# Altium schematic sheet Alimentacion_3.SchDoc
size A4
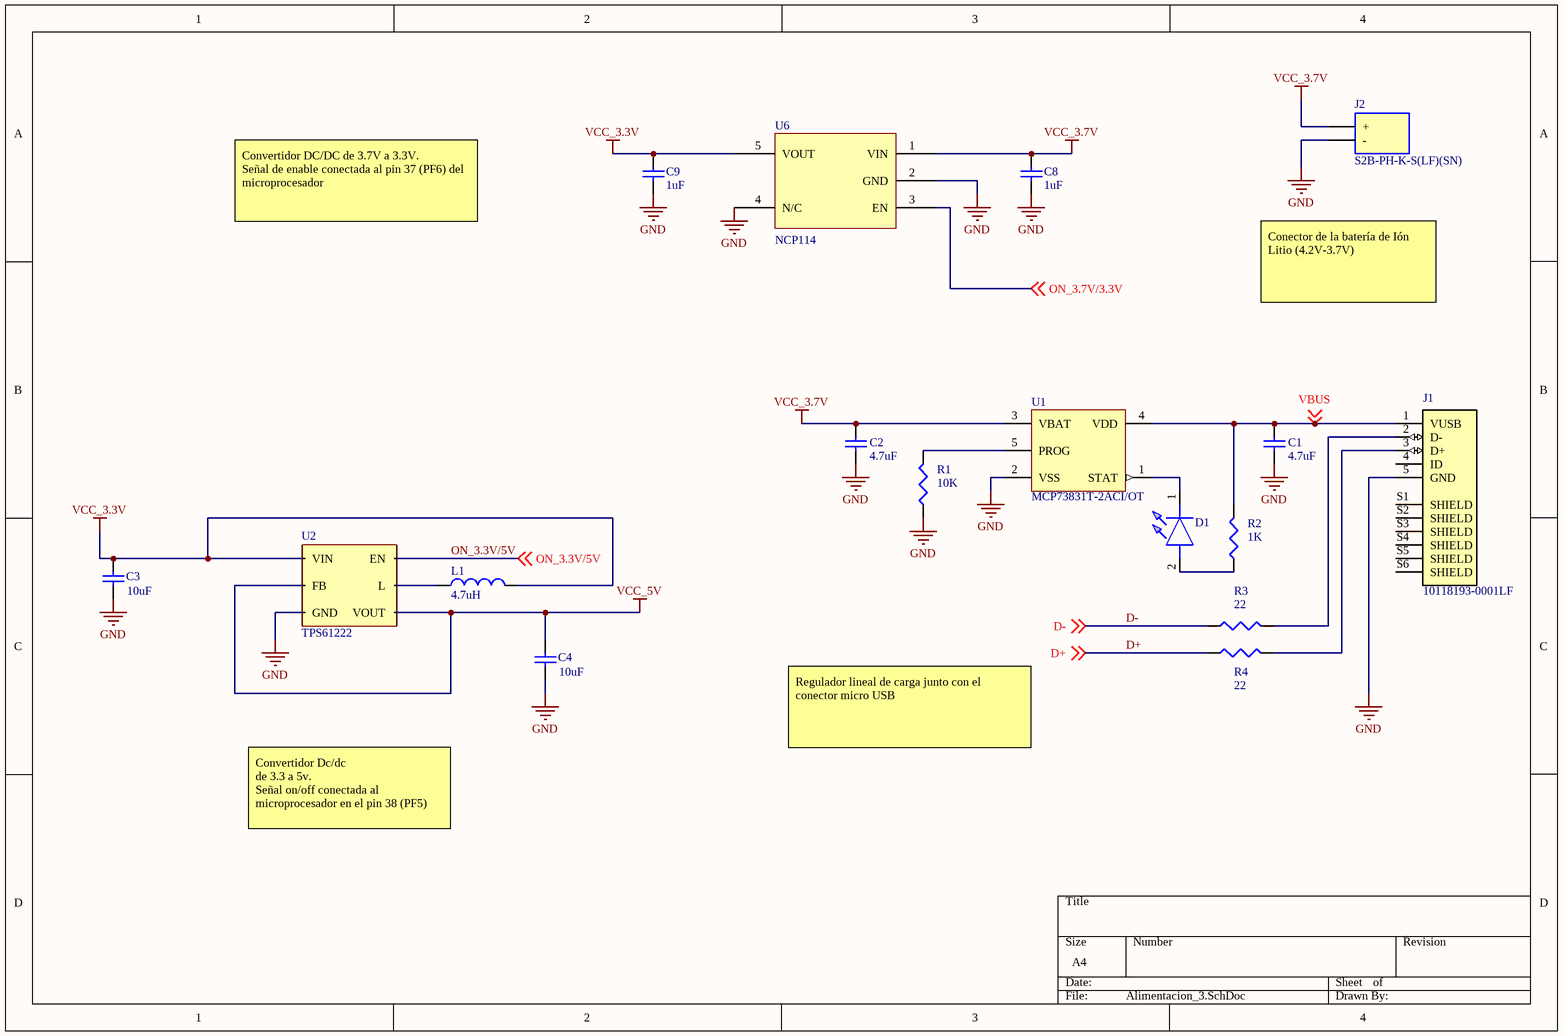
[diagram p0: Alimentacion_3.SchDoc]

## Parts
C1  value 4.7uF  [0603]  (hidden comment: Cap)
C2  value 4.7uF  [0603]  (hidden comment: Cap)
C3  value 10uF  [0603]  (hidden comment: Cap)
C4  value 10uF  [0603]  (hidden comment: Cap)
C8  value 1uF  [0603]  (hidden comment: Cap)
C9  value 1uF  [0603]  (hidden comment: Cap)
D1  150060GS75000  [LEDC1608X80N]  (value not drawn)
J1  10118193-0001LF  [FCI_10118193-0001LF_10118193-0001LF(Primary)]
J2  S2B-PH-K-S(LF)(SN)  [S2B_Lipo_Header]
L1  value 4.7uH  [0603]  (hidden comment: Inductor)
R1  value 10K  [0603]  (hidden comment: Res3)
R2  value 1K  [0603]  (hidden comment: Res3)
R3  value 22  [0603]  (hidden comment: Res3)
R4  value 22  [0603]  (hidden comment: Res3)
U1  MCP73831T-2ACI/OT  [SOT-23-OT5_N]
U2  TPS61222  [TPS61222DCK]
U6  NCP114  [NCP114-TSOP5]

## Nets
GND: C1.1 C2.1 C3.1 C4.1 C8.1 C9.1 J1.5(GND) J2.2(-) R1.1 U1.2(VSS) U2.GND U6.2(GND) U6.4(N/C)
VCC_3.3V: C3.2 C9.2 L1.2 U2.VIN U6.5(VOUT)
VCC_3.7V: C2.2 C8.2 J2.1(+) U1.3(VBAT) U6.1(VIN)
VCC_5V: C4.2 U2.FB U2.VOUT
D+: R4.1 ; off-sheet D+
D-: R3.1 ; off-sheet D-
ON_3.3V/5V: U2.EN ; off-sheet ON_3.3V/5V
ON_3.7V/3.3V: U6.3(EN) ; off-sheet ON_3.7V/3.3V
VBUS: C1.2 J1.1(VUSB) R2.2 U1.4(VDD) ; off-sheet VBUS
NetD1_1: D1.1(K) U1.1(STAT)
NetD1_2: D1.2(A) R2.1
NetJ1_2: J1.2(D-) R3.2
NetJ1_3: J1.3(D+) R4.2
NetL1_1: L1.1 U2.L
NetR1_2: R1.2 U1.5(PROG)

Not connected (* = marked no-connect by the designer): J1 4(ID) S1(SHIELD) S2(SHIELD) S3(SHIELD) S4(SHIELD) S5(SHIELD) S6(SHIELD)

## Notes on the sheet
- Convertidor DC/DC de 3.7V a 3.3V.
  Señal de enable conectada al pin 37 (PF6) del microprocesador
- Conector de la batería de Ión Litio (4.2V-3.7V)
- Regulador lineal de carga junto con el conector micro USB
- Convertidor Dc/dc
  de 3.3 a 5v.
  Señal on/off conectada al microprocesador en el pin 38 (PF5)

## Library data of the parts
C1-C4 C8 C9 = Cap_0603: Capacitor; Published: 8-Jun-2000; LatestRevisionDate: 17-Jul-2002; LatestRevisionNote: Re-released for DXP Platform.; PackageReference: RAD-0.3; Publisher: Altium Limited; PackageDescription: Radial Cap, Thru-Hole; 2 Leads; 0.3 in Pin Spacing; Supplier 1: RSComponents; Supplier 2: Digi-Key
  C1 C2: Supplier Part Number 1: 6911155; Supplier Part Number 2: 399-5503-6-ND
  C3 C4: Supplier Part Number 1: 7882893; Supplier Part Number 2: 445-7486-1-ND
  C8 C9: Supplier Part Number 1: 4612708; Supplier Part Number 2: 478-1251-1-ND
D1 = 150060GS75000: Wurth Elektronik WL-SMCW 520 nm Green LED, 1608 (0603) Clear SMD package; Geometry.Height: 0.8mm; Manufacturer_Name: Wurth Elektronik; Manufacturer_Part_Number: 150060GS75000; RS Part Number: 8154209P; RS Price/Stock: http://uk.rs-online.com/web/p/products/8154209P; Arrow Part Number: 150060GS75000; Arrow Price/Stock: http://uk.rs-online.com/web/p/products/8154209P; Datasheet Link: https://componentsearchengine.com/Datasheets/2/150060GS75000.pdf; Supplier 1: RSComponents; Supplier Part Number 1: 6973715; Supplier 2: Digi-Key; Supplier Part Number 2: 732-4971-1-ND
J1 = 10118193-0001LF: Single Port 5 Contact Shielded SMT MICRO USB B-Type Receptacle; MF: Amphenol FCI; Availability: Unavailable; Package: None; Price: None; SnapEDA_Link: https://www.snapeda.com/parts/10118193-0001LF/Amphenol%20FCI/view-part/?ref=snap; MP: 10118193-0001LF; Value: *; Supplier 1: RSComponents; Supplier Part Number 1: 8632989; Supplier 2: Digi-Key; Supplier Part Number 2: 609-4616-1-ND
J2 = S2B-PH-K-S(LF)(SN): PH-2.0mm Header side entry 2 way JST PH Series, Series Number S2B, 2mm Pitch 2 Way 1 Row Right Angle PCB Header, Through Hole Termination, 2A; Manufacturer_Name: JST (JAPAN SOLDERLESS TERMINALS); Geometry.Height: 6mm; Manufacturer_Part_Number: S2B-PH-K-S(LF)(SN); RS Part Number: 1724889; RS Price/Stock: http://uk.rs-online.com/web/p/products/1724889; Arrow Part Number: S2B-PH-K-S(LF)(SN); Arrow Price/Stock: https://www.arrow.com/en/products/s2b-ph-k-s-lf-sn/jst-manufacturing; Datasheet Link: http://uk.rs-online.com/web/p/products/8201494; Supplier 1: RSComponents; Supplier Part Number 1: 8201494; Supplier 2: Digi-Key; Supplier Part Number 2: 455-1719-ND
L1 = Inductor: Code_IEC: 1005; Published: 8-Jun-2000; LatestRevisionDate: 29-May-2009; LatestRevisionNote: IPC-7351 Footprint Added.; PackageReference: 0402-A; Publisher: Altium Limited; PackageDescription: Chip Inductor; Code_JEITA: 0402; Supplier 1: RSComponents; Supplier Part Number 1: 7754697; Supplier 2: Digi-Key; Supplier Part Number 2: 445-3607-1-ND
R1-R4 = Res3: Resistor; Published: 8-Jun-2000; LatestRevisionDate: 29-May-2009; LatestRevisionNote: IPC-7351 Footprint Added.; PackageReference: J1-0603; Publisher: Altium Limited; PackageDescription: Chip Resistor; Supplier 1: RSComponents; Supplier 2: Digi-Key
  R1: Supplier Part Number 1: 1251173; Supplier Part Number 2: P10.0KHDKR-ND
  R2: Supplier Part Number 1: 8145889; Supplier Part Number 2: P1.00KHCT-ND
  R3 R4: Supplier Part Number 1: 7408928; Supplier Part Number 2: P22GCT-ND
U1 = MCP73831T-2ACI/OT: Miniature Single-Cell, Fully Integrated Li-Ion, Li-Polymer Charge Management Controller, 4.2V, 5-Pin SOT-23, Industrial Temperature, Tape and Reel; Published: 29-Jan-2009; LatestRevisionDate: 27-Nov-2009; LatestRevisionNote: Updated to datasheet revision E, Sep-2008; DatasheetVersion: revE, Sep-2008; PackageVersion: revBB, Aug-2009; PackageReference: SOT-23-OT5; Publisher: Altium Limited; PackageDescription: 5-Lead Plastic Small Outline Transistor (OT) [SOT-23]; Code_IPC: SOT23-5; ComponentLink1Description: Datasheet; ComponentLink1URL: http://ww1.microchip.com/downloads/en/DeviceDoc/21984e.pdf; ComponentLink2Description: Packaging Specification; ComponentLink2URL: http://www.microchip.com/stellent/groups/techpub_sg/documents/packagingspec/en012702.pdf; ComponentLink3Description: Microchip.com Home; ComponentLink3URL: http://www.microchip.com/; Supplier 1: RSComponents; Supplier Part Number 1: 7386360; Supplier 2: Digi-Key; Supplier Part Number 2: MCP73831T-2ATI/OTCT-ND
U2 = TPS61222: Supplier 1: RSComponents; Supplier Part Number 1: 8123647; Supplier 2: Digi-Key; Supplier Part Number 2: 296-24172-1-ND
U6 = NCP114: Supplier 1: RSComponents; Supplier Part Number 1: 1263178; Supplier 2: Digi-Key; Supplier Part Number 2: NCP114ASN330T1GOSCT-ND